# EAGLE design kg_op_ubtb (EAGLE 9.4.2)
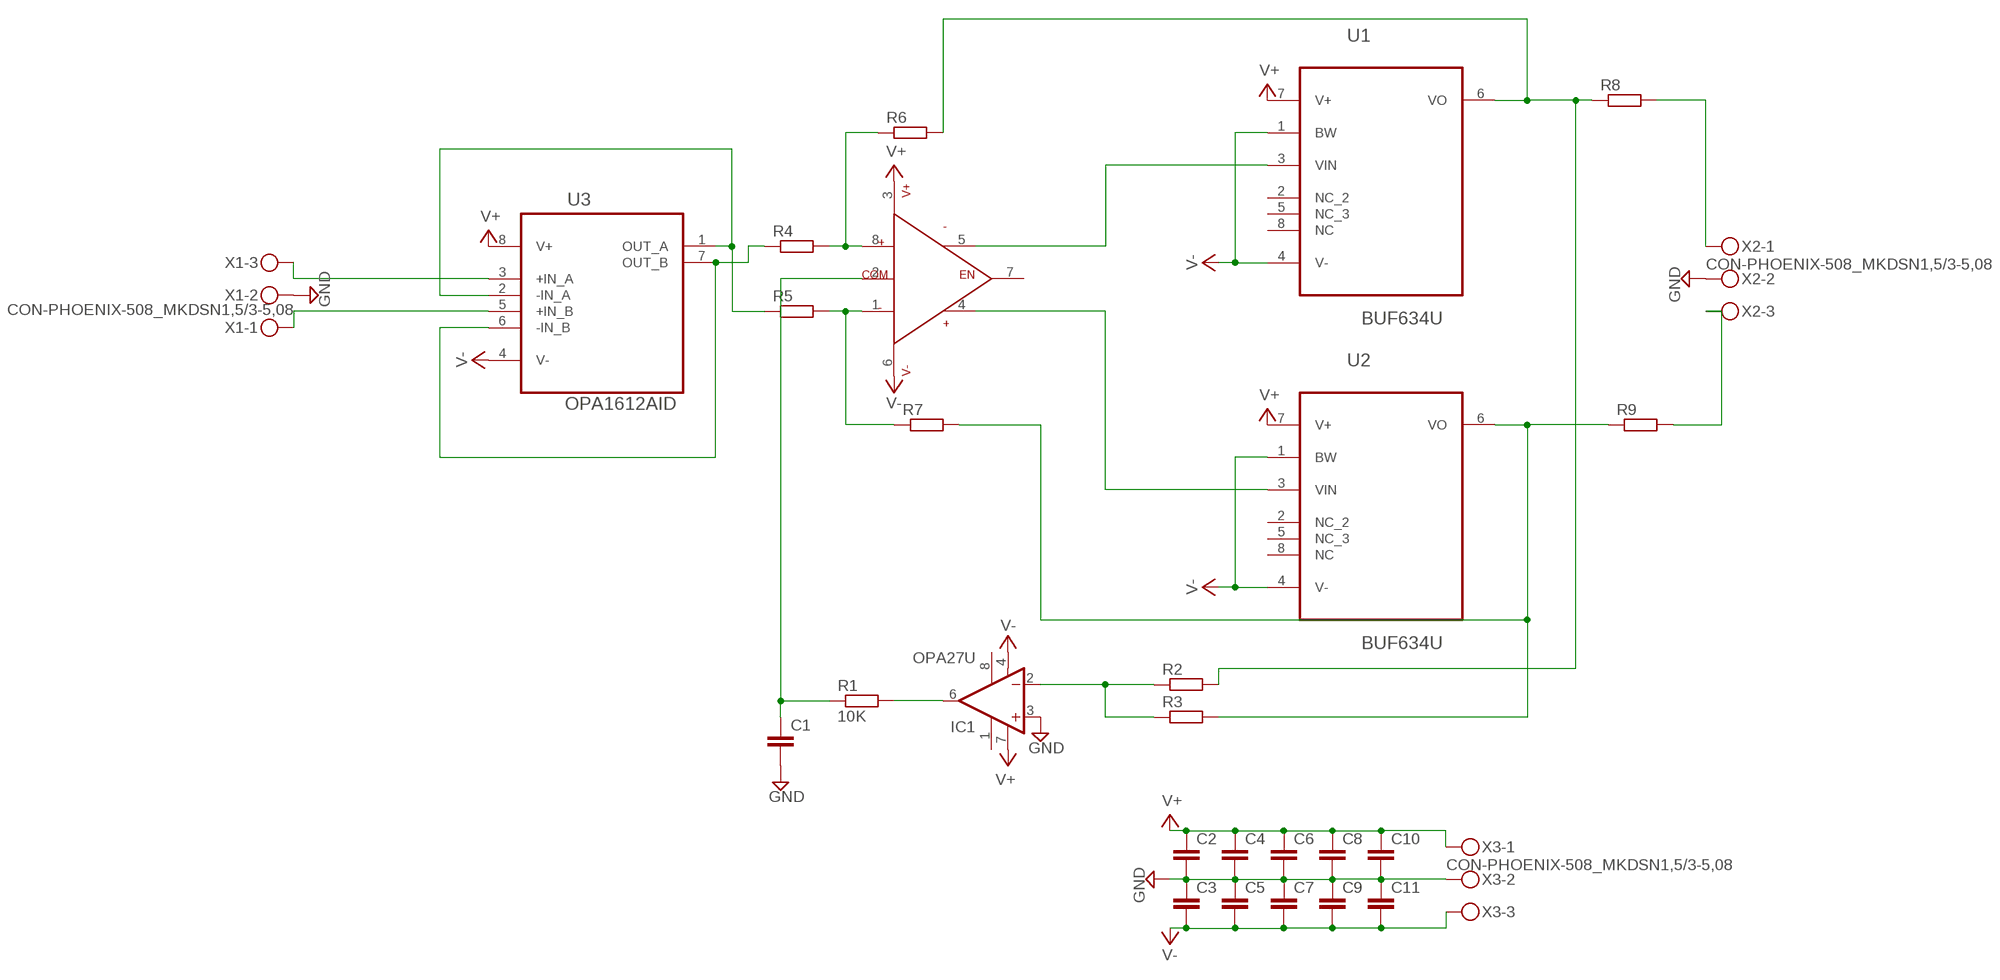
[diagram p0: schematic, sheet 1]

## Parts
C1  C-EUC0805  [C0805]
C2  C-EUC0805  [C0805]
C3  C-EUC0805  [C0805]
C4  C-EUC0805  [C0805]
C5  C-EUC0805  [C0805]
C6  C-EUC0805  [C0805]
C7  C-EUC0805  [C0805]
C8  C-EUC0805  [C0805]
C9  C-EUC0805  [C0805]
C10  C-EUC0805  [C0805]
C11  C-EUC0805  [C0805]
IC1  OPA27U  [SO08]
R1  10K  R-EU_MELF0204W  [MINI_MELF-0204W]
R2  R-EU_MELF0204W  [MINI_MELF-0204W]
R3  R-EU_MELF0204W  [MINI_MELF-0204W]
R4  R-EU_MELF0204W  [MINI_MELF-0204W]
R5  R-EU_MELF0204W  [MINI_MELF-0204W]
R6  R-EU_MELF0204W  [MINI_MELF-0204W]
R7  R-EU_MELF0204W  [MINI_MELF-0204W]
R8  R-EU_MELF0204W  [MINI_MELF-0204W]
R9  R-EU_MELF0204W  [MINI_MELF-0204W]
U1  BUF634U  [SOIC127P600X175-8N]
U2  BUF634U  [SOIC127P600X175-8N]
U3  OPA1612AID  [SOIC127P600X175-8N]
U$1  OPA1632  [SO8]
X1  CON-PHOENIX-508_MKDSN1,5/3-5,08  [CON-PHOENIX-508_MKDSN1,5/3-5,08]
X2  CON-PHOENIX-508_MKDSN1,5/3-5,08  [CON-PHOENIX-508_MKDSN1,5/3-5,08]
X3  CON-PHOENIX-508_MKDSN1,5/3-5,08  [CON-PHOENIX-508_MKDSN1,5/3-5,08]

## Nets
GND: C1.2 C2.2 C3.1 C4.2 C5.1 C6.2 C7.1 C8.2 C9.1 C10.2 C11.1 IC1.3(+IN) X1.2 X2.2 X3.2
N$1: U1.3(VIN) U$1.5(OUT-)
N$2: U2.3(VIN) U$1.4(OUT+)
N$3: R5.1 U3.1(OUT_A) U3.2(-IN_A)
N$4: R4.1 U3.6(-IN_B) U3.7(OUT_B)
N$5: R4.2 R6.1 U$1.8(IN+)
N$6: U3.3(+IN_A) X1.3
N$7: U3.5(+IN_B) X1.1
N$8: R5.2 R7.1 U$1.1(IN-)
N$9: C1.1 R1.1 U$1.2(COM)
N$10: IC1.6(OUT) R1.2
N$11: IC1.2(-IN) R2.1 R3.1
N$12: R3.2 R7.2 R9.1 U2.6(VO)
N$14: R2.2 R6.2 R8.1 U1.6(VO)
N$16: R9.2 X2.3
N$17: R8.2 X2.1
V+: C2.1 C4.1 C6.1 C8.1 C10.1 IC1.7(V+) U1.7(V+) U2.7(V+) U3.8(V+) U$1.3(V+) X3.1
V-: C3.2 C5.2 C7.2 C9.2 C11.2 IC1.4(V-) U1.1(BW) U1.4(V-) U2.1(BW) U2.4(V-) U3.4(V-) U$1.6(V-) X3.3
Unconnected: IC1.1(OFF1) IC1.8(OFF2) U1.2(NC_2) U1.5(NC_3) U1.8(NC) U2.2(NC_2) U2.5(NC_3) U2.8(NC) U$1.7(EN)

## Library data of the parts
C1-C11 = Vwvwbg:C-EU: CAPACITOR, European symbol
IC1 = linear:OPA*?: Ultra-Low Noise, Precision OP AMP Source: http://focus.ti.com/lit/ds/symlink/opa27.pdf http://focus.ti.com .. opa241.pdf
R1-R9 = Vwvwbg:R-EU_: RESISTOR, European symbol
U1 U2 = Texas Instruments_By_element14_Batch_1:BUF634U: 250mA HIGH-SPEED BUFFER; MPN: BUF634U; OC_FARNELL: 1212267; OC_NEWARK: 27C6567; PACKAGE: SOIC-8; SUPPLIER: TI
U3 = Texas Instruments_By_element14_Batch_1:OPA1612AID: AUDIO OPERATIONAL AMPLIFIERS; MPN: OPA1612AID; OC_FARNELL: 1754265; OC_NEWARK: 25R6133; PACKAGE: SOIC-8; SUPPLIER: TI
U$1 = Vwvwbg:OPA1632
X1-X3 = Vwvwbg:CON-PHOENIX-508_MKDSN1,5/3-5,08: MKDSN 1,5/ 3-5,08 Printklemme Nennstrom: 13,5 A Nennspannung: 250 V Rastermaß: 5,08 mm Polzahl: 3 Anschlussart: Schraubanschluss Montage: Löten Anschlussrichtung Leiter/Platine: 0 ° Artikelnummer: 1729131 Source: http://eshop.phoenixcontact.com .. 1729131.pdf

## Board
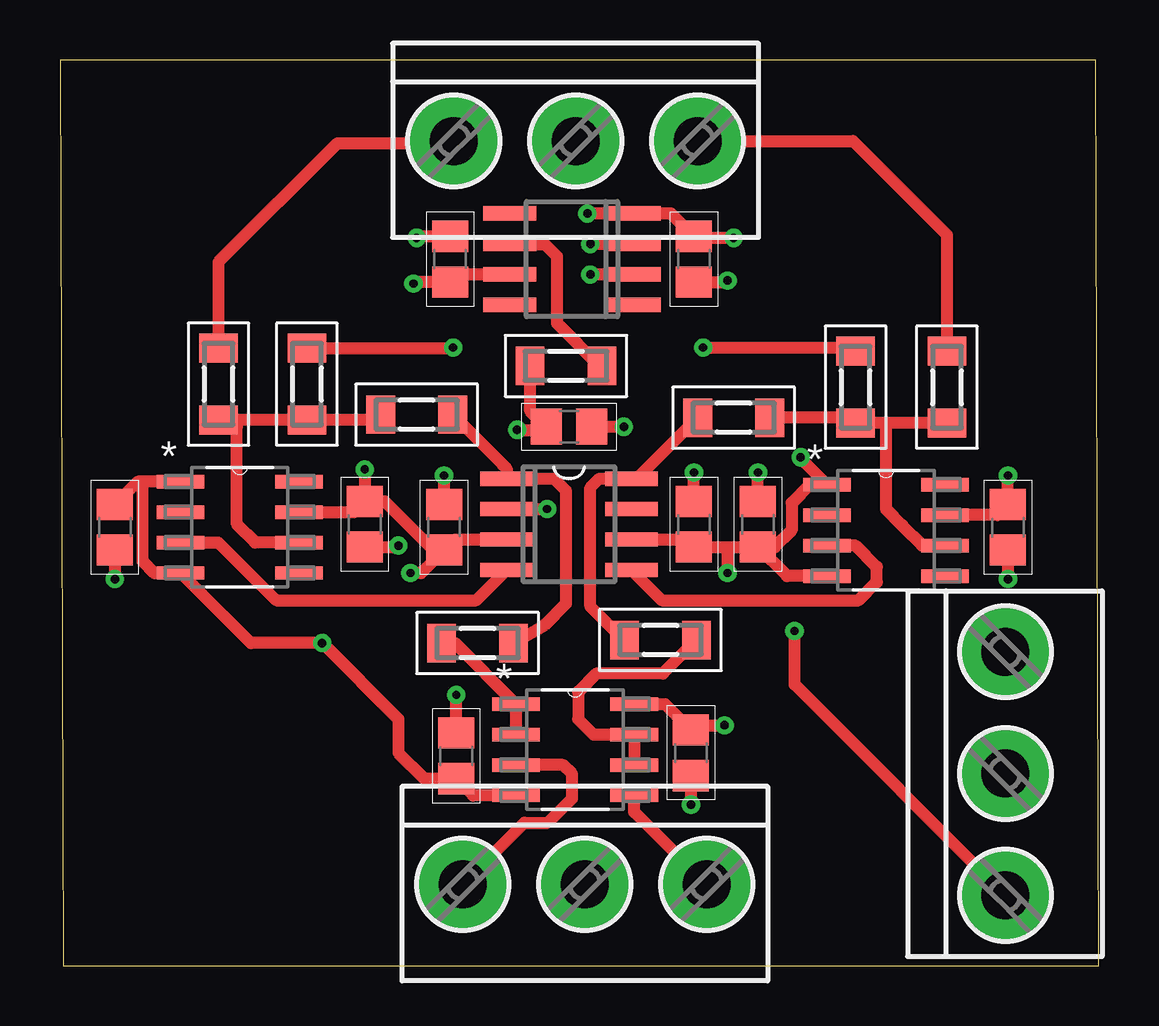
[diagram p1: board, top side]
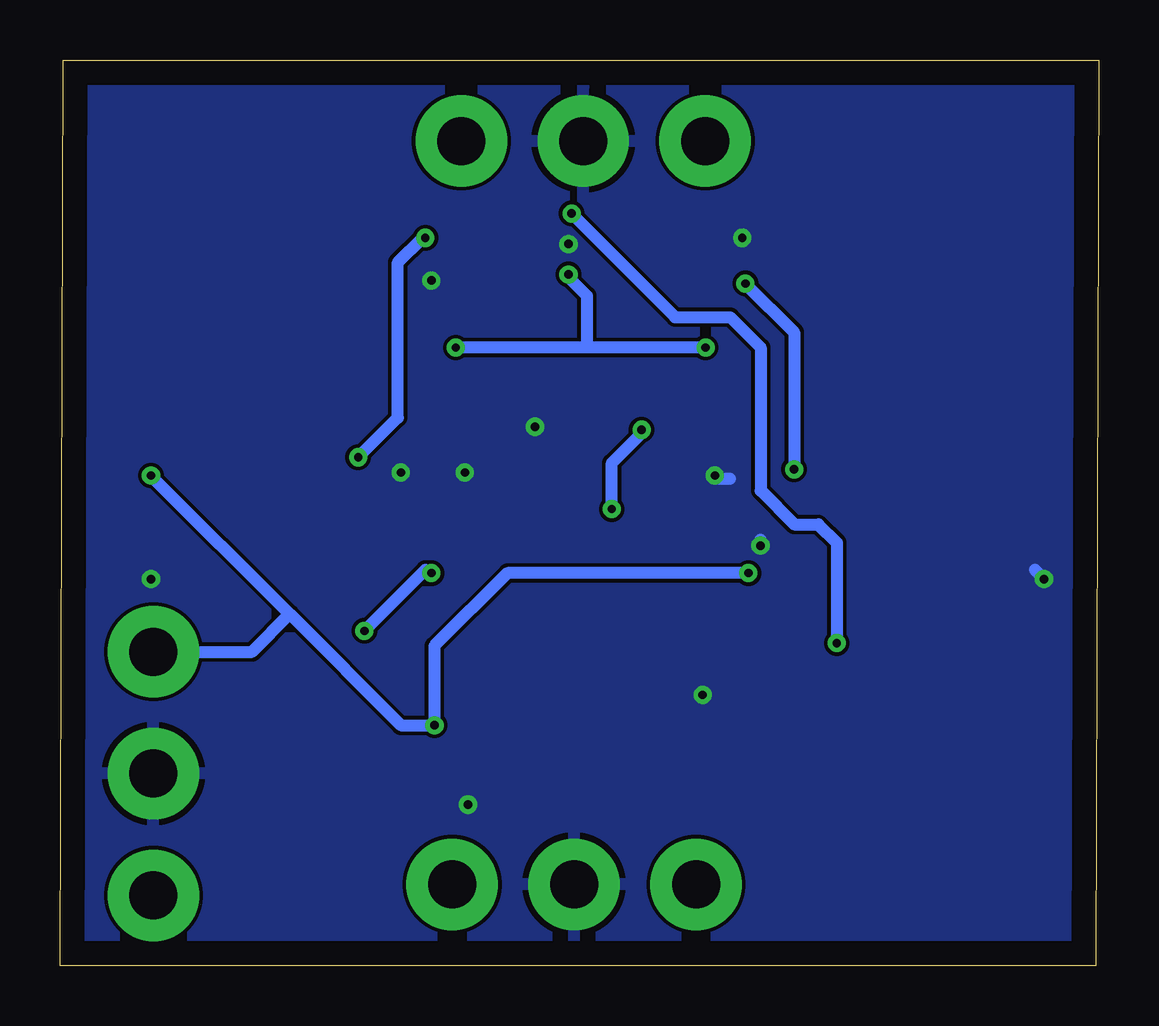
[diagram p2: board, bottom side, seen from below]

Size 43.29 x 37.77 mm. Coordinates in mm from the lower left corner, seen from the top.
Outline: 0.13,0 43.29,0 43.16,37.77 0,37.77 0.13,0
Copper layers (1*16): Top 0.035mm / dielectric 1.5mm / Bottom 0.035mm
Design rules "default": minimum track width 6mil, minimum drill 0.35mm, track to track 6mil, track to pad 6mil, pad to pad 6mil, via to via 6mil, smd to smd 6mil, copper to edge 40mil, drill to drill 6mil, minimum pad ring 10mil, minimum via ring 8mil, stop-mask expansion 4mil, vias tented up to drill 0mil, thermal gap 10mil

### Footprints (pad centres in the part's own frame; a part is rotated, then mirrored left to right if it is on the bottom)
C0805 = smd 1.3 x 1.5: 1 -0.95,0; 2 0.95,0
SO08 = smd 0.6 x 2.2: 1 -1.905,-2.6; 2 -0.635,-2.6; 3 0.635,-2.6; 4 1.905,-2.6; 5 1.905,2.6; 6 0.635,2.6; 7 -0.635,2.6; 8 -1.905,2.6
MINI_MELF-0204W = smd 1.2 x 1.6: 1 -1.5,0; 2 1.5,0
SOIC127P600X175-8N = smd 1.981 x 0.559: 1 -2.464,1.905; 2 -2.464,0.635; 3 -2.464,-0.635; 4 -2.464,-1.905; 5 2.464,-1.905; 6 2.464,-0.635; 7 2.464,0.635; 8 2.464,1.905
SO8 = smd 0.6 x 2.2: 1 -1.905,-2.6; 2 -0.635,-2.6; 3 0.635,-2.6; 4 1.905,-2.6; 5 1.905,2.6; 6 0.635,2.6; 7 -0.635,2.6; 8 -1.905,2.6
CON-PHOENIX-508_MKDSN1,5/3-5,08 = drill 2 pad 3.81: 1 -7.641,0.025; 2 -2.561,0.025; 3 2.519,0.025

### Placement (x,y rotation side)
C1  21.21,22.48 0 top
C2  26.29,8.89 270 top
C3  26.42,18.41 270 top
C4  39.5,18.29 270 top
C5  16.51,8.76 270 top
C6  16.26,29.46 90 top
C7  26.42,29.46 90 top
C8  12.7,18.41 270 top
C9  29.08,18.41 270 top
C10  16,18.29 90 top
C11  2.29,18.29 90 top
IC1  21.34,29.46 90 top
R1  21.08,25.02 0 top
R2  33.15,24.13 270 top
R3  10.29,24.26 270 top
R4  25.02,13.59 180 top
R5  17.4,13.46 0 top
R6  28.07,22.86 0 top
R7  14.86,22.99 180 top
R8  36.96,24.13 90 top
R9  6.6,24.26 90 top
U1  34.42,18.16 0 top
U2  7.49,18.29 0 top
U3  21.46,9.02 0 top
U$1  21.21,18.41 270 top
X1  19.3,3.43 180 top
X2  18.92,34.42 180 top
X3  39.37,5.46 270 top

### Tracks (layer width: path | path; a pad name or v marks a point on that pad's centre or on a via)
GND  (via drill 0.35)
  Top 0.508: C1.2 v23.49,22.48 | C11.1 v2.29,16.13 | C8.2 14.04,17.46 v14.1,17.53 | C10.2 v16,20.45 | C9.1 v29.08,20.57 | C3.1 v26.42,20.57 | C4.2 v39.5,16.13 | C7.1 27.75,28.51 v27.81,28.57 | C6.2 14.92,30.41 v14.86,30.35 | C2.2 v26.29,6.73 | C5.1 v16.51,11.3 | IC1.3 v22.1,30.1
  Bottom 0.508: v2.29,16.13 2.67,16.51 | v14.1,17.53 14.1,17.78 | v16,20.45 15.88,20.32 15.37,20.32
  pour Bottom: -8.76,57.15 53.47,57.15 53.47,-5.08 -8.76,-5.08
N$1
  Top 0.508: U$1.5 25.08,15.24 33.27,15.24 34.04,16 34.04,16.64 33.15,17.53 U1.3
N$2
  Top 0.508: U$1.4 17.34,15.24 9.02,15.24 6.6,17.65 U2.3
N$3
  Top 0.508: U3.2 U3.1 16.46,13.46 R5.1
N$4
  Top 0.508: U3.6 U3.7 22.22,9.65 21.59,10.29 21.59,11.43 22.35,12.19 25.12,12.19 R4.1
N$5
  Top 0.508: R4.2 22.88,14.2 22.1,14.99 22.1,19.94 22.48,20.32 U$1.8 24.03,20.32 R6.1
N$6
  Top 0.508: X1.3 19.35,5.97 20.32,5.97 21.34,6.99 21.34,8 20.95,8.38 U3.3
N$7
  Top 0.508: X1.1 23.93,6.42 U3.5
N$8
  Top 0.508: R7.1 18.47,20.88 18.61,20.74 U$1.1 20.57,20.32 21.08,19.81 21.08,15.11 20.17,14.2 R5.2
N$9  (via drill 0.35)
  Top 0.508: R1.1 19.58,23.16 C1.1 20.13,22.35 v19.05,22.35 | U$1.2 v20.3,19.05
  Bottom 0.508: v20.3,19.05 20.3,20.98 19.05,22.23 v19.05,22.35
N$10
  Top 0.508: IC1.6 20.19,30.1 20.7,29.59 20.7,26.8 22.48,25.02 R1.2
N$11  (via drill 0.35)
  Top 0.508: R3.1 16.36,25.76 v16.38,25.78 | v26.8,25.78 33,25.78 R2.1 | IC1.2 v22.1,28.83
  Bottom 0.508: v16.38,25.78 21.34,25.78 | 21.34,25.78 v26.8,25.78 | v22.1,28.83 22.1,28.7 21.34,27.94 21.34,25.78
N$12
  Top 0.508: U2.6 8.13,17.65 7.37,18.41 7.37,22.48 7.09,22.76 R9.1 R3.2 13.13,22.76 R7.2
N$14
  Top 0.508: U1.6 35.93,17.53 35.1,18.35 35.1,18.36 34.42,19.05 34.42,22.63 | R8.1 34.42,22.63 | 34.42,22.63 R2.2 32.92,22.86 R6.2
N$16
  Top 0.508: X2.3 16.3,34.29 11.56,34.29 6.6,29.34 R9.2
N$17
  Top 0.508: X2.1 33.05,34.39 36.96,30.48 R8.2
V+  (via drill 0.35)
  Top 0.508: U2.7 12.26,18.92 C8.1 | C10.1 16.44,17.78 U$1.3 | U1.7 39.05,18.8 C4.1 v39.5,20.45 | IC1.7 16.57,28.83 C6.1 14.8,28.51 v14.73,28.45 | U3.8 25.21,10.92 C2.1 26.48,10.03 v27.69,10.03 | v12.7,20.7 C8.1 | C10.1 15.56,17.34 13.53,19.36 C8.1 | C10.1 15.05,16.38 v14.61,16.38
  Bottom 0.508: v14.73,28.45 12.7,26.42 v12.7,20.7 | v39.5,20.45 33.72,14.67 | 33.72,14.67 29.08,10.03 v27.69,10.03 27.69,13.34 24.64,16.38 v14.61,16.38 | X3.1 35.29,13.1 33.72,14.67
V-  (via drill 0.35)
  Top 0.508: U$1.6 26.1,17.78 C3.2 27.81,17.46 | U1.4 30.29,16.26 C9.2 | 27.81,17.46 C9.2 | U2.1 3.56,20.19 | 3.56,20.19 3.24,20.19 C11.2 | U3.4 17.21,7.11 C5.2 15.17,7.81 14.1,8.89 14.1,10.29 v10.92,13.46 7.95,13.46 U2.4 3.94,16.38 3.44,16.88 3.44,20.08 3.56,20.19 | C9.2 29.78,17.46 30.48,18.16 30.48,19.3 31.24,20.07 U1.1 30.86,21.16 v30.86,21.21 | v28.07,30.35 26.48,30.35 C7.2 25.46,31.37 IC1.4 v21.97,31.37 | X3.3 30.61,11.73 v30.61,13.97 | v27.81,16.38 27.81,17.46
  Bottom 0.508: v30.86,21.21 29.21,22.86 29.21,29.34 28.19,30.35 v28.07,30.35 | v21.97,31.37 17.65,27.05 15.37,27.05 14.1,25.78 14.1,19.81 12.7,18.41 11.68,18.41 10.92,17.65 v10.92,13.46 | v30.61,13.97 28.07,16.51 27.81,16.51 v27.81,16.38